# Altium project Sleep_Tracker.PrjPcb
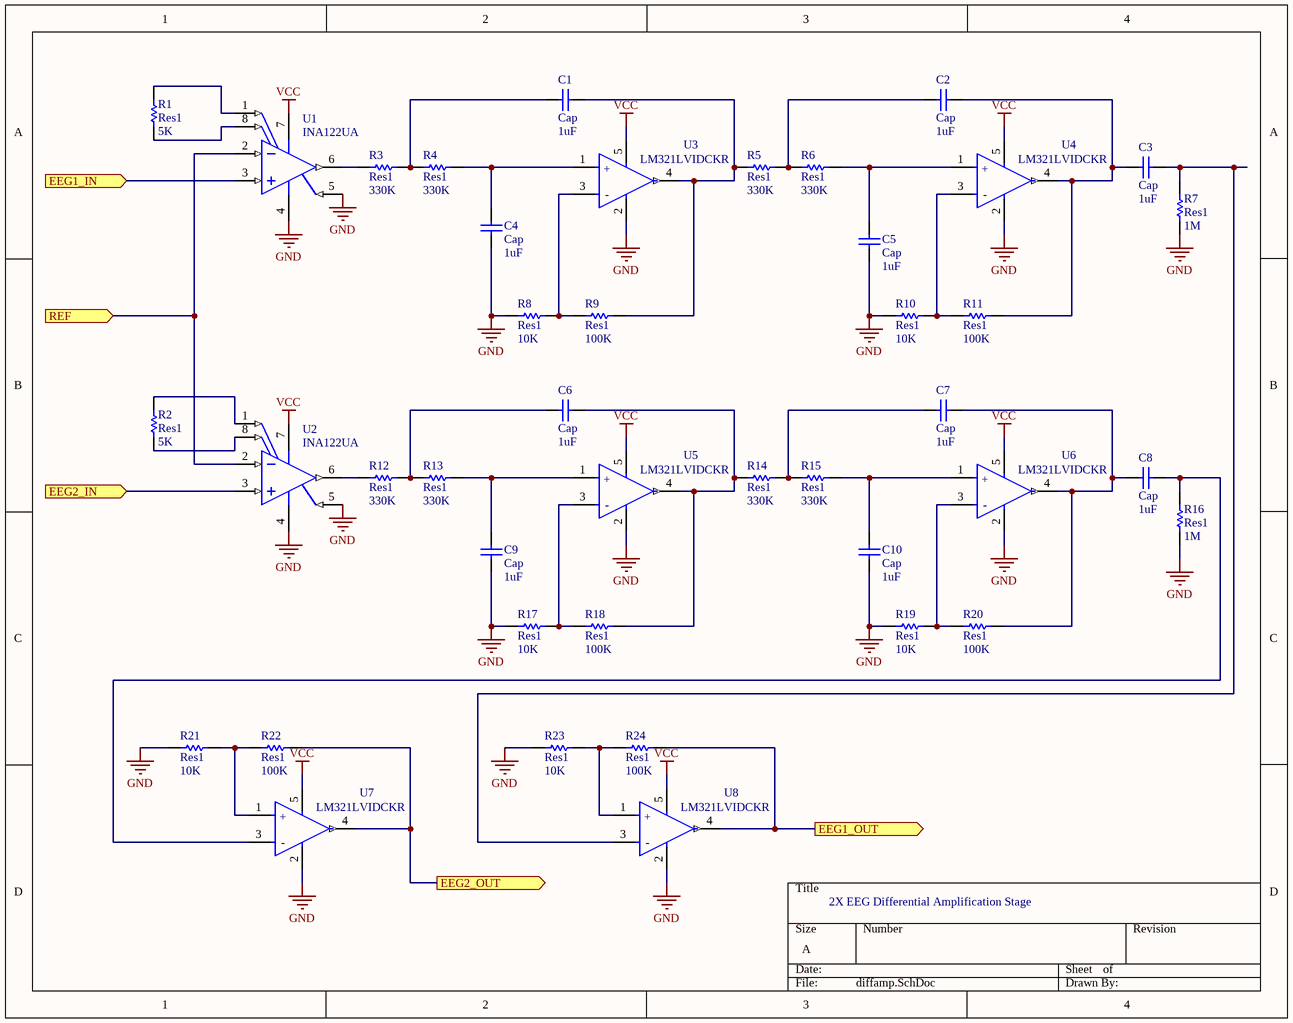
[diagram p0: diffamp.SchDoc]
1 sheet, 42 parts. Net scope: flat (ports and power ports of the same name join across sheets).
Board file: diffamp.PcbDoc

## Sheet diffamp.SchDoc
size A; SheetNumber: 1; SheetTotal: 1

### Parts
C1  Cap  value 1uF  [6-0805_M]
C2  Cap  value 1uF  [6-0805_M]
C3  Cap  value 1uF  [6-0805_M]
C4  Cap  value 1uF  [6-0805_M]
C5  Cap  value 1uF  [6-0805_M]
C6  Cap  value 1uF  [6-0805_M]
C7  Cap  value 1uF  [6-0805_M]
C8  Cap  value 1uF  [6-0805_M]
C9  Cap  value 1uF  [6-0805_M]
C10  Cap  value 1uF  [6-0805_M]
R1  Res1  value 5K  [6-0805_M]
R2  Res1  value 5K  [6-0805_M]
R3  Res1  value 330K  [6-0805_M]
R4  Res1  value 330K  [6-0805_M]
R5  Res1  value 330K  [6-0805_M]
R6  Res1  value 330K  [6-0805_M]
R7  Res1  value 1M  [6-0805_M]
R8  Res1  value 10K  [6-0805_M]
R9  Res1  value 100K  [6-0805_M]
R10  Res1  value 10K  [6-0805_M]
R11  Res1  value 100K  [6-0805_M]
R12  Res1  value 330K  [6-0805_M]
R13  Res1  value 330K  [6-0805_M]
R14  Res1  value 330K  [6-0805_M]
R15  Res1  value 330K  [6-0805_M]
R16  Res1  value 1M  [6-0805_M]
R17  Res1  value 10K  [6-0805_M]
R18  Res1  value 100K  [6-0805_M]
R19  Res1  value 10K  [6-0805_M]
R20  Res1  value 100K  [6-0805_M]
R21  Res1  value 10K  [6-0805_M]
R22  Res1  value 100K  [6-0805_M]
R23  Res1  value 10K  [6-0805_M]
R24  Res1  value 100K  [6-0805_M]
U1  INA122UA  [D0008A_L]
U2  INA122UA  [D0008A_L]
U3  LM321LVIDCKR  [FP-DCK0005A-IPC_B]
U4  LM321LVIDCKR  [FP-DCK0005A-IPC_B]
U5  LM321LVIDCKR  [FP-DCK0005A-IPC_B]
U6  LM321LVIDCKR  [FP-DCK0005A-IPC_B]
U7  LM321LVIDCKR  [FP-DCK0005A-IPC_B]
U8  LM321LVIDCKR  [FP-DCK0005A-IPC_B]

### Ports
EEG1_IN (in), EEG1_OUT (out), EEG2_IN (in), EEG2_OUT (out), REF (in)

### Nets
GND: C4.2 C5.2 C9.2 C10.2 R7.2 R8.1 R10.1 R16.2 R17.1 R19.1 R21.1 R23.1 U1.4(V-) U1.5(REF) U2.4(V-) U2.5(REF) U3.2(V-) U4.2(V-) U5.2(V-) U6.2(V-) U7.2(V-) U8.2(V-)
VCC: U1.7(V+) U2.7(V+) U3.5(V+) U4.5(V+) U5.5(V+) U6.5(V+) U7.5(V+) U8.5(V+)
NetC1_1: C1.1 R3.2 R4.1
NetC1_2: C1.2 R5.1 R9.2 U3.4(OUT)
NetC2_1: C2.1 R5.2 R6.1
NetC2_2: C2.2 C3.1 R11.2 U4.4(OUT)
NetC3_2: C3.2 R7.1 U8.3(IN-)
NetC4_1: C4.1 R4.2 U3.1(IN+)
NetC5_1: C5.1 R6.2 U4.1(IN+)
NetC6_1: C6.1 R12.2 R13.1
NetC6_2: C6.2 R14.1 R18.2 U5.4(OUT)
NetC7_1: C7.1 R14.2 R15.1
NetC7_2: C7.2 C8.1 R20.2 U6.4(OUT)
NetC8_2: C8.2 R16.1 U7.3(IN-)
NetC9_1: C9.1 R13.2 U5.1(IN+)
NetC10_1: C10.1 R15.2 U6.1(IN+)
NetR1_1: R1.1 U1.1(RG)
NetR1_2: R1.2 U1.8(RG)
NetR2_1: R2.1 U2.1(RG)
NetR2_2: R2.2 U2.8(RG)
NetR3_1: R3.1 U1.6(VO)
NetR8_2: R8.2 R9.1 U3.3(IN-)
NetR10_2: R10.2 R11.1 U4.3(IN-)
NetR12_1: R12.1 U2.6(VO)
NetR17_2: R17.2 R18.1 U5.3(IN-)
NetR19_2: R19.2 R20.1 U6.3(IN-)
NetR21_2: R21.2 R22.1 U7.1(IN+)
NetR22_2: R22.2 U7.4(OUT) ; port EEG2_OUT
NetR23_2: R23.2 R24.1 U8.1(IN+)
NetR24_2: R24.2 U8.4(OUT) ; port EEG1_OUT
NetU1_2: U1.2(VIN-) U2.2(VIN-) ; port REF
NetU1_3: U1.3(VIN+) ; port EEG1_IN
NetU2_3: U2.3(VIN+) ; port EEG2_IN

### Notes on the sheet
- 2X EEG Differential Amplification Stage
- (in symbol CMP-04895-000147-1) +; -

### Library data of the parts
C1-C10 = Cap: Capacitor; Published: 8-Jun-2000; LatestRevisionDate: 17-Jul-2002; LatestRevisionNote: Re-released for DXP Platform.; PackageReference: RAD-0.3; Publisher: Altium Limited; PackageDescription: Radial Cap, Thru-Hole; 2 Leads; 0.3 in Pin Spacing
R1-R24 = Res1: Resistor; Published: 8-Jun-2000; LatestRevisionDate: 17-Jul-2002; LatestRevisionNote: Re-released for DXP Platform.; PackageReference: AXIAL-0.3; Publisher: Altium Limited; PackageDescription: Axial Device, Thru-Hole; 2 Leads; 0.3 in Pin Spacing
U1 U2 = CMP-0944-00048-2: Single Supply, MicroPower Instrumentation Amplifier, -40 to 85 degC, 8-pin SOIC (D8), Green (RoHS & no Sb/Br); Manufacturer: Texas Instruments; Number of Channels: 1; Quiescent Current (+/-)(Typ)(mA): 0.06; Gain(V/V): 5 to 10000; Input Bias Current (+/-)(Max)(nA): 50; Noise at 1kHz(Typ)(nV/rt(Hz)): 60; Vs(Max)(V): 36; Non-Linearity (+/-)(Max)(%): 0.024; Input Offset Drift (+/-)(Max)(uV/Degrees Celsius): 5; CMRR(Min)(dB): 76; Vs(Min)(V): 2.2; Input Offset (+/-)(Max)(uV): 500; ComponentLink2Description: Datasheet; SubFamily: Single Supply; Code_JEDEC: MS-012; DatasheetVersion: SBOS069; Mounting Technology: Surface Mount; PackageReference: D0008A; ComponentLink1URL: http://www.ti.com/; ComponentLink3URL: http://www.ti.com/litv/pdf/msoi002j; ComponentLink1Description: Manufacturer URL; Eco-Plan: Green (RoHS & no Sb/Br); PackageVersion: 4040047-3/M, 06/2011; PartNumber: INA122UA; ComponentLink2URL: http://www.ti.com/general/docs/lit/getliterature.tsp?genericPartNumber=INA122&fileType=pdf; ComponentLink3Description: Package Specification; PackageDescription: 8-Pin Plastic Small Outline, Body 4.9 x 3.9 mm, Pitch 1.27 mm
U3-U8 = CMP-04895-000147-1: IC OPAMP GP 1 CIRCUIT SC70-5; RoHS Compliant: Yes